# EasyEDA schematic SCH_led-flasher.json
TITLE: Sheet_1; REV: 1.0; Date: 2026-06-19; Sheet: 1/1; Drawn By: bannuazmeera; Company: Your Company
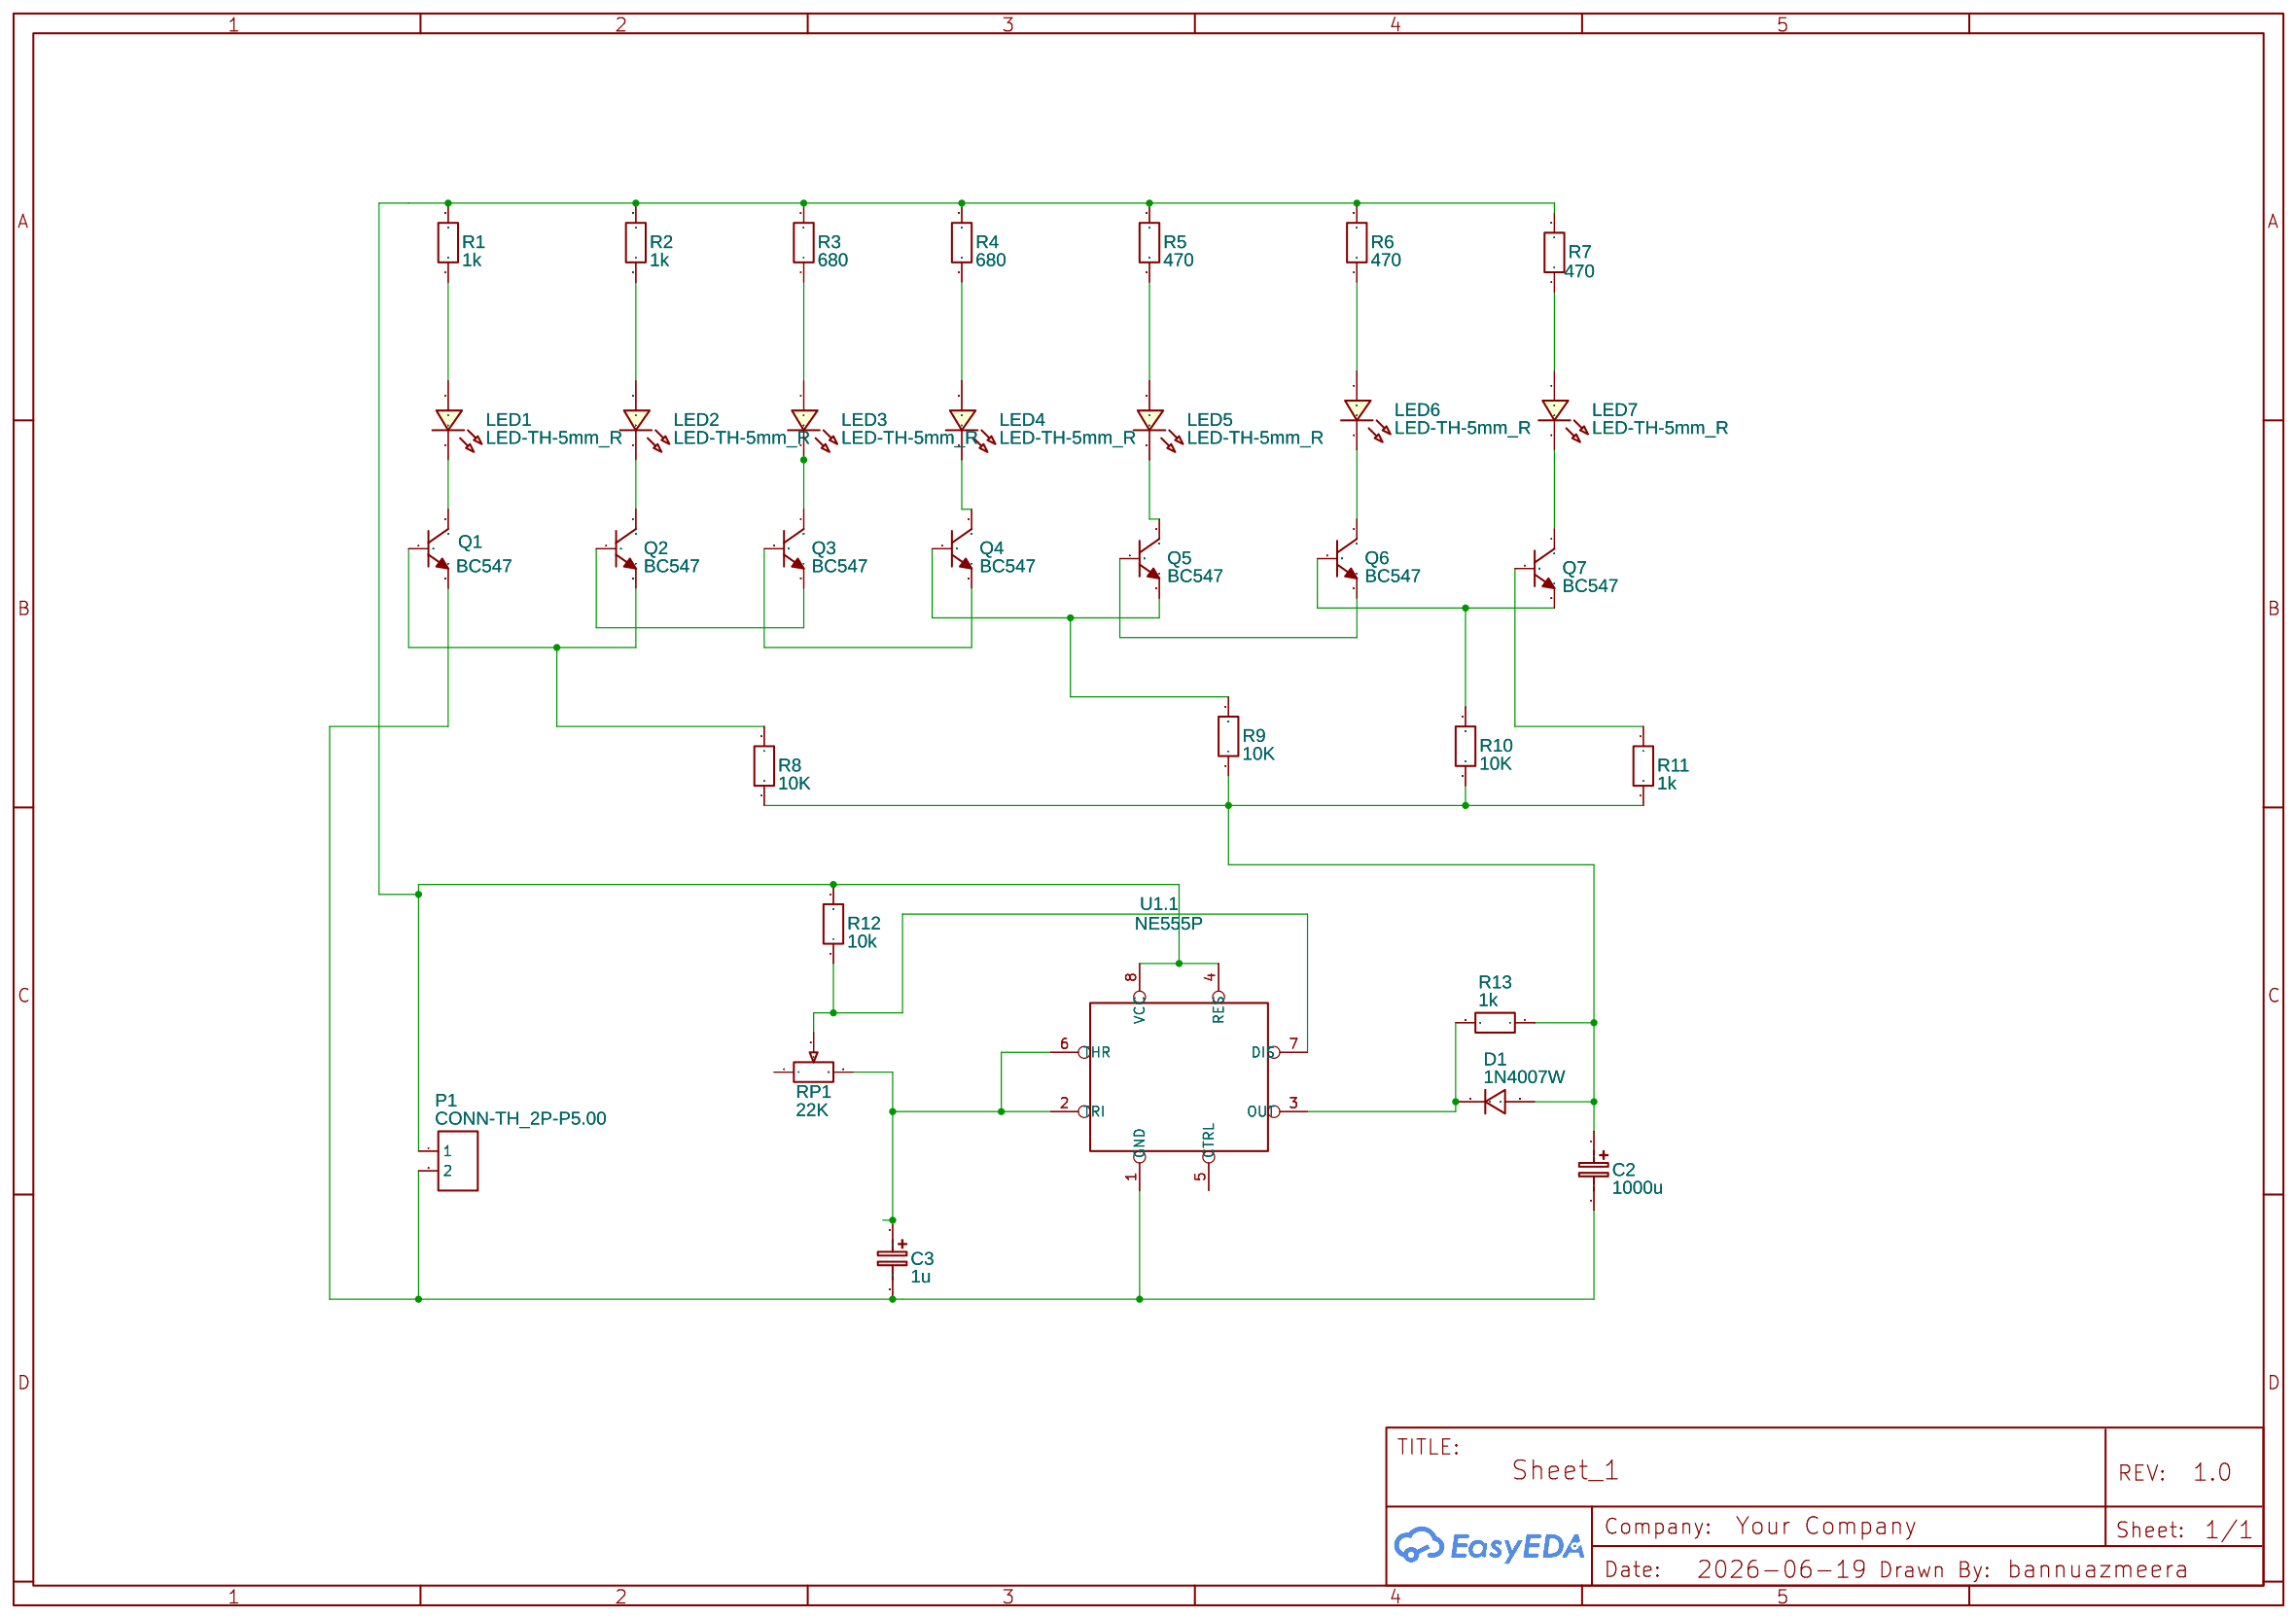
[diagram p0: schematic sheet]

## Parts
C2  1000u  [CASE-A_3216]
C3  1u  [CASE-A_3216]
D1  1N4007W  [SOD-123_L2.8-W1.8-LS3.7-RD]
LED1  LED-TH-5mm_R  [LED-TH_BD5.0_RED]
LED2  LED-TH-5mm_R  [LED-TH_BD5.0_RED]
LED3  LED-TH-5mm_R  [LED-TH_BD5.0_RED]
LED4  LED-TH-5mm_R  [LED-TH_BD5.0_RED]
LED5  LED-TH-5mm_R  [LED-TH_BD5.0_RED]
LED6  LED-TH-5mm_R  [LED-TH_BD5.0_RED]
LED7  LED-TH-5mm_R  [LED-TH_BD5.0_RED]
P1  CONN-TH_2P-P5.00  [CONN-TH_2P-P5.00]
Q1  BC547  [TO-92-3_L4.5-W3.5-P1.27-L]
Q2  BC547  [TO-92-3_L4.5-W3.5-P1.27-L]
Q3  BC547  [TO-92-3_L4.5-W3.5-P1.27-L]
Q4  BC547  [TO-92-3_L4.5-W3.5-P1.27-L]
Q5  BC547  [TO-92-3_L4.5-W3.5-P1.27-L]
Q6  BC547  [TO-92-3_L4.5-W3.5-P1.27-L]
Q7  BC547  [TO-92-3_L4.5-W3.5-P1.27-L]
R1  1k  [R0603]
R2  1k  [R0603]
R3  680  [R0603]
R4  680  [R0603]
R5  470  [R0603]
R6  470  [R0603]
R7  470  [R0603]
R8  10K  [R0603]
R9  10K  [R0603]
R10  10K  [R0603]
R11  1k  [R0603]
R12  10k  [R0603]
R13  1k  [R0603]
RP1  22K  [RES-ADJ-TH_3386P]
U1  NE555P  [DIP-8_L9.8-W6.6-P2.54-LS7.6-BL]  (section 1)

## Library data of the parts
C2 C3 = C_Tan_SMD_A_EU: Contributor: LCEDA_Lib
D1 = 1N4007W: Supplier: LCSC; Supplier Part: C328592; Manufacturer: BLUE ROCKET; Contributor: LCEDA_Lib
LED1-LED7 = LED-TH-5mm_R: Manufacturer: EVERLIGHT(台湾亿光); Manufacturer Part: 333-2SURD/S530-A3; Supplier Part: C87271; Supplier: LCSC; Contributor: LCEDA_Lib
P1 = CONN-TH_2P-P5.00: Supplier: LCSC; Contributor: LCEDA_Lib
Q1-Q7 = BC547: Contributor: LCSC; Supplier: LCSC; Supplier Part: C2910381; Manufacturer: CJ(江苏长电/长晶); Manufacturer Part: BC547(RANGE:420-800); JLCPCB Part Class: Extended Part
R1-R13 = R_0603_EU: Contributor: LCEDA_Lib
RP1 = R_3386P_EU: Supplier: LCSC; Contributor: LCEDA_Lib; Value(Ω): 10K
U1 = NE555: Supplier: LCSC; Manufacturer: TI(德州仪器); Supplier Part: C46749; JLCPCB Part Class: Extended Part; subpart_no: 1

## Nets
Net-(C2-1): C2.1 D1.2 R8.1 R9.1 R10.1 R11.1 R13.1
Net-(C2-2): C2.2 C3.2 P1.2 Q1.3(E) U1.1(GND)
Net-(C3-1): C3.1 RP1.3 U1.2(TRI) U1.6(THR)
Net-(D1-1): D1.1 R13.2 U1.3(OUT)
Net-(LED1-1): LED1.1 R1.1
Net-(LED1-2): LED1.2 Q1.1(C)
Net-(LED2-1): LED2.1 R2.1
Net-(LED2-2): LED2.2 Q2.1(C)
Net-(LED3-1): LED3.1 R3.1
Net-(LED3-2): LED3.2 Q3.1(C)
Net-(LED4-1): LED4.1 R4.1
Net-(LED4-2): LED4.2 Q4.1(C)
Net-(LED5-1): LED5.1 R5.1
Net-(LED5-2): LED5.2 Q5.1(C)
Net-(LED6-1): LED6.1 R6.1
Net-(LED6-2): LED6.2 Q6.1(C)
Net-(LED7-1): LED7.1 R7.1
Net-(LED7-2): LED7.2 Q7.1(C)
Net-(P1-1): P1.1 R1.2 R2.2 R3.2 R4.2 R5.2 R6.2 R7.2 R12.2 U1.4(RES) U1.8(VCC)
Net-(Q1-2): Q1.2(B) Q2.3(E) R8.2
Net-(Q2-2): Q2.2(B) Q3.3(E)
Net-(Q3-2): Q3.2(B) Q4.3(E)
Net-(Q4-2): Q4.2(B) Q5.3(E) R9.2
Net-(Q5-2): Q5.2(B) Q6.3(E)
Net-(Q6-2): Q6.2(B) Q7.3(E) R10.2
Net-(Q7-2): Q7.2(B) R11.2
Net-(R12-1): R12.1 RP1.2 U1.7(DIS)

Not connected (* = marked no-connect by the designer): RP1 1; U1 5(CTRL)
